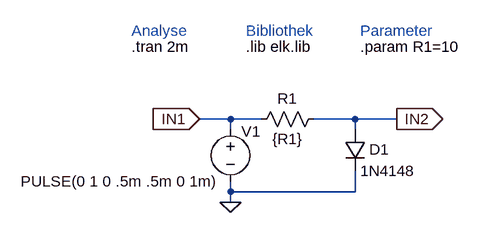
[diagram p0: schematic Draft_Diode_1N4148.asc]
Draft_Diode_1N4148.asc, the LTspice schematic file:
Version 4
SHEET 1 880 680
WIRE 144 64 96 64
WIRE 192 64 144 64
WIRE 336 64 272 64
WIRE 400 64 336 64
WIRE 144 80 144 64
WIRE 336 80 336 64
WIRE 144 176 144 160
WIRE 336 176 336 144
WIRE 336 176 144 176
WIRE 144 192 144 176
FLAG 144 192 0
FLAG 96 64 IN1
IOPIN 96 64 In
FLAG 400 64 IN2
IOPIN 400 64 Out
SYMBOL res 176 80 R270
WINDOW 0 32 56 VTop 2
WINDOW 3 1 56 VBottom 2
SYMATTR InstName R1
SYMATTR Value {R1}
SYMBOL diode 320 80 R0
WINDOW 0 38 31 Left 2
SYMATTR InstName D1
SYMATTR Value 1N4148
SYMBOL voltage 144 64 R0
WINDOW 3 -323 96 Left 2
WINDOW 123 0 0 Left 0
WINDOW 39 0 0 Left 0
WINDOW 0 17 19 Left 2
SYMATTR Value PULSE(0 1 0 .5m .5m 0 1m)
SYMATTR InstName V1
TEXT -8 -48 Left 2 !.tran 2m
TEXT 168 -48 Left 2 !.lib elk.lib
TEXT 344 -48 Left 2 !.param R1=10
TEXT -8 -72 Left 2 ;Analyse
TEXT 168 -72 Left 2 ;Bibliothek
TEXT 344 -72 Left 2 ;Parameter

The netlist it stands for:
* Draft_Diode_1N4148.asc
R1 IN1 IN2 {R1}
D1 IN2 0 1N4148
V1 IN1 0 PULSE(0 1 0 .5m .5m 0 1m)
.model D D
.lib standard.dio
.tran 2m
.lib elk.lib
.param R1=10
* Analyse
* Bibliothek
* Parameter
.backanno
.end

* Results of the author's LTspice run, read from the files saved beside the schematic
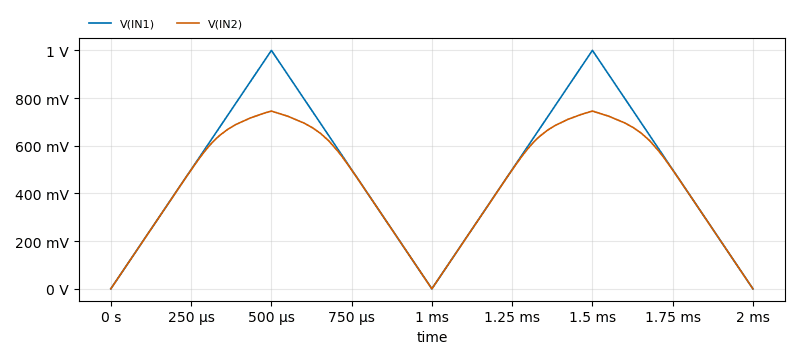
[diagram p1: Transient Analysis of Draft_Diode_1N4148.asc, plotted from the saved traces]
* Transient Analysis, 1 run:
*   V(IN1): min 0 V, max 999.8 mV, average 500 mV, rms 577.7 mV, last 0 V
*   V(IN2): min -221.3 nV, max 745.3 mV, average 454 mV, rms 510.6 mV, last -221.3 nV